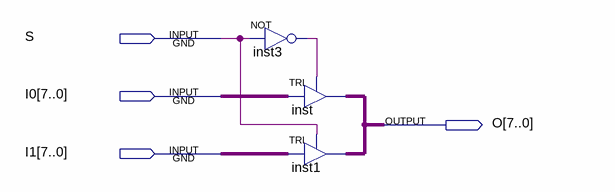
[diagram p0: schematic sheet]
// Quartus schematic mx2_8b.bdf as structural Verilog: 3 symbols, 4 pins
module mx2_8b (
  input  S,
  input  [7:0] I0,
  input  [7:0] I1,
  output [7:0] O
);

  wire inst3_out;

  not inst3 (inst3_out, S);
  TRI inst[7:0] (.IN(I0), .OE(inst3_out), .OUT(O));
  TRI inst1[7:0] (.IN(I1), .OE(S), .OUT(O));
endmodule
